# EAGLE schematic tiny13_charlie4_50mm_AAA_optical_diag_2 (EAGLE 6.2)
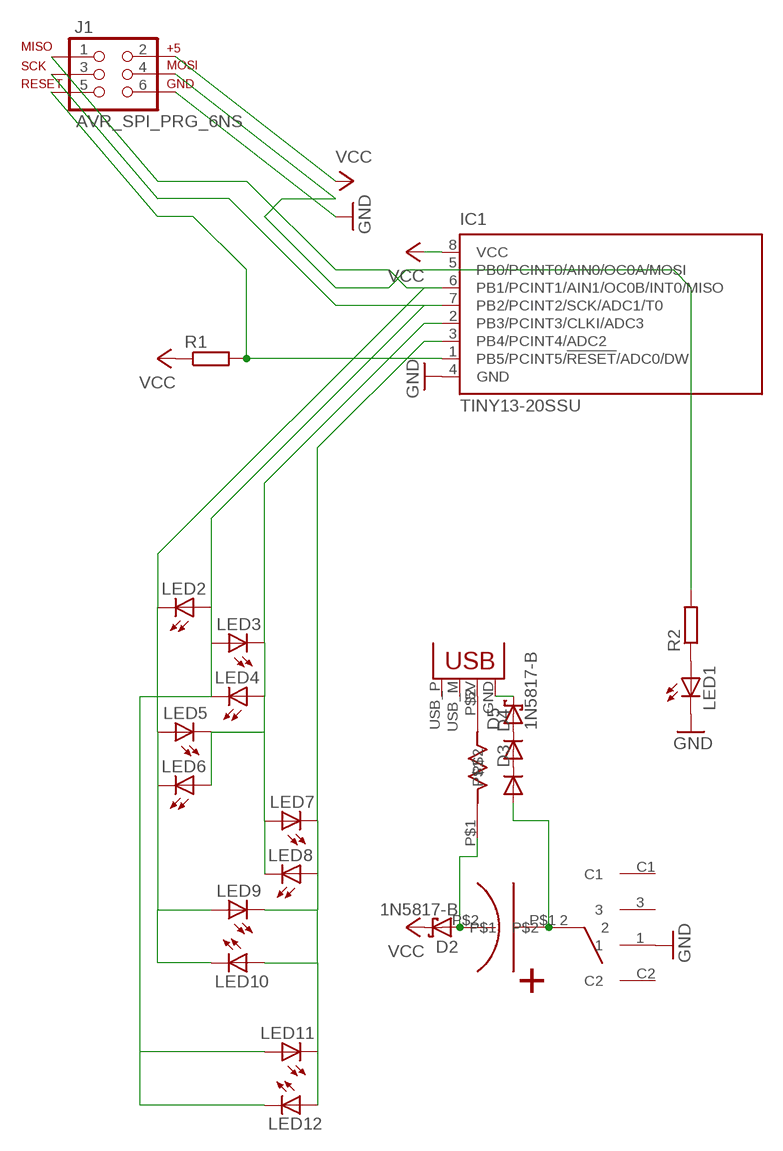
[diagram p0: schematic, sheet 1]

## Parts
D2  1N5817-B  [DO41-7.6]
D3  DIODE-D-5  [D-5]
D4  DIODE-D-5  [D-5]
D5  1N5817-B  [DO41-7.6]
IC1  TINY13-20SSU  [8S1]
J1  AVR_SPI_PRG_6NS  [2X3-NS]
LED1  LED3MM  [LED3MM]
LED2  LED3MM  [LED3MM]
LED3  LED3MM  [LED3MM]
LED4  LED3MM  [LED3MM]
LED5  LED3MM  [LED3MM]
LED6  LED3MM  [LED3MM]
LED7  LED3MM  [LED3MM]
LED8  LED3MM  [LED3MM]
LED9  LED3MM  [LED3MM]
LED10  LED3MM  [LED3MM]
LED11  LED3MM  [LED3MM]
LED12  LED3MM  [LED3MM]
R1  R-EU_0204/5  [0204/5]
R2  R-EU_0204/5  [0204/5]
U$1  R-7  [R-7]
U$4  SWITCH  [SWITCH]
U$5  NICHICON_12F  [NICHICON_10X30]
X1  USBPCB  [USB-A-PCB]

## Nets
GND: IC1.4(GND) J1.6 LED1.K(C) U$4.1
N$1: IC1.2(PB3/PCINT3/CLKI/ADC3) LED3.K(C) LED4.A LED5.K(C) LED6.A LED7.A LED8.K(C)
N$2: IC1.7(PB2/PCINT2/SCK/ADC1/T0) J1.3 LED2.A LED3.A LED4.K(C) LED11.A LED12.K(C)
N$3: LED1.A R2.1
N$4: IC1.3(PB4/PCINT4/ADC2) LED7.K(C) LED8.A LED9.K(C) LED10.A LED11.K(C) LED12.A
N$5: IC1.5(PB0/PCINT0/AIN0/OC0A/MOSI) J1.4 R2.2
N$6: IC1.1(PB5/PCINT5/!RESET!/ADC0/DW) J1.5 R1.2
N$7: D3.A U$4.2 U$5.P$1
N$8: IC1.6(PB1/PCINT1/AIN1/OC0B/INT0/MISO) J1.1 LED2.K(C) LED5.A LED6.K(C) LED9.A LED10.K(C)
N$9: D3.C D4.A
N$10: D4.C D5.A
N$11: D5.C X1.GND
N$12: U$1.P$2 X1.5V(VBUS)
N$13: D2.A U$1.P$1 U$5.P$2
N$14: J1.2
VCC: D2.C IC1.8(VCC) R1.1
Unconnected: U$4.3 U$4.C1 U$4.C2 X1.USB_M(D-) X1.USB_P(D+)

## Library data of the parts
D2 D5 = diode:1N581*: 1.0A SCHOTTKY BARRIER RECTIFIER Source: http://www.diodes.com/datasheets/ds23001.pdf
D3 D4 = diode:DIODE-: DIODE
IC1 = atmel:TINY13: 8-bit AVR Microcontroller with 1K Bytes In-System Programmable Flash Source: http://www.atmel.com/dyn/resources/prod_documents/2535S.pdf; MPN: ATTINY13-20SSU; OC_FARNELL: 1455133; OC_NEWARK: 58M3771
J1 = SparkFun:AVR_SPI_PRG_6: AVR ISP 6 Pin This is the reduced ISP connector for AVR programming. Common on Arduino. This footprint will take up less PCB space and can be used with a 10-pin to 6-pin adapter such as SKU: BOB-08508
LED1-LED12 = 0-svo:LED: LED OSRAM: - CHIPLED LG R971, LG N971, LY N971, LG Q971, LY Q971, LO R971, LY R971 LH N974, LH R974 LS Q976, LO Q976, LY Q976 LO Q996 - Hyper CHIPLED LW Q18S LB Q993, LB Q99A, LB R99A - SideLED LS A670, LO A670, LY A670, LG A670, LP A670 LB A673, LV A673, LT A673, LW A673 LH A674 LY A675 LS A676, LA A676, LO A676, LY A676, LW A676 LS A679, LY A679, LG A679 - Hyper Micro SIDELED® LS Y876, LA Y876, LO Y876, LY Y876 LT Y87S - SmartLED LW L88C, LW L88S LB L89C, LB L89S, LG L890 LS L89K, LO L89K, LY L89K LS L896, LA L896, LO L896, LY L896 - TOPLED LS T670, LO T670, LY T670, LG T670, LP T670 LSG T670, LSP T670, LSY T670, LOP T670, LYG T670 LG T671, LOG T671, LSG T671 LB T673, LV T673, LT T673, LW T673 LH T674 LS T676, LA T676, LO T676, LY T676, LB T676, LH T676, LSB T676, LW T676 LB T67C, LV T67C, LT T67C, LS T67K, LO T67K, LY T67K, LW E67C LS E67B, LA E67B, LO E67B, LY E67B, LB E67C, LV E67C, LT E67C LW T67C LS T679, LY T679, LG T679 LS T770, LO T770, LY T770, LG T770, LP T770 LB T773, LV T773, LT T773, LW T773 LH T774 LS E675, LA E675, LY E675, LS T675 LS T776, LA T776, LO T776, LY T776, LB T776 LHGB T686 LT T68C, LB T68C - Hyper Mini TOPLED® LB M676 - Mini TOPLED Santana® LG M470 LS M47K, LO M47K, LY M47K Source: http://www.osram.convergy.de/
R1 R2 = resistor:R-EU_: RESISTOR, European symbol
U$1 = Mrule:R-7
U$4 = Mrule:SWITCH
U$5 = Mrule:NICHICON_12F
X1 = SparkFun:USB: USB Connectors USB-B-PTH is fully proven SKU : PRT-00139 USB-miniB is fully proven SKU : PRT-00587 USB-A-PCB is untested. USB-A-H is throughly reviewed, but untested. Spark Fun Electronics SKU : PRT-00437 USB-B-SMT is throughly reviewed, but untested. Needs silkscreen touching up. USB-A-S has not been used/tested USB-MB-H has not been used/tested